# Altium schematic sheet ART-Pi_LCD&Camera.SchDoc: LCD_Connector
size A3; DocumentNumber: 9; Revision: V1.5; SheetNumber: 9; SheetTotal: 11; PageSetup: Record=PageOptions|CenterHorizontal=True|CenterVertical=True|PrintScale=1.01|XCorrection=1.00|YCorrection=1.00|PrintKind=0|BorderSize=5000000|LeftOffset=0|BottomOffset=0|Orientation=2|PaperLength=1000|PaperWidth=1000|Scale=100|PaperSource=7|PrintQuality=600|MediaType=1|DitherType=10|PrintScaleMode=1|PaperKind=A3(297x420mm)|PaperIndex=8
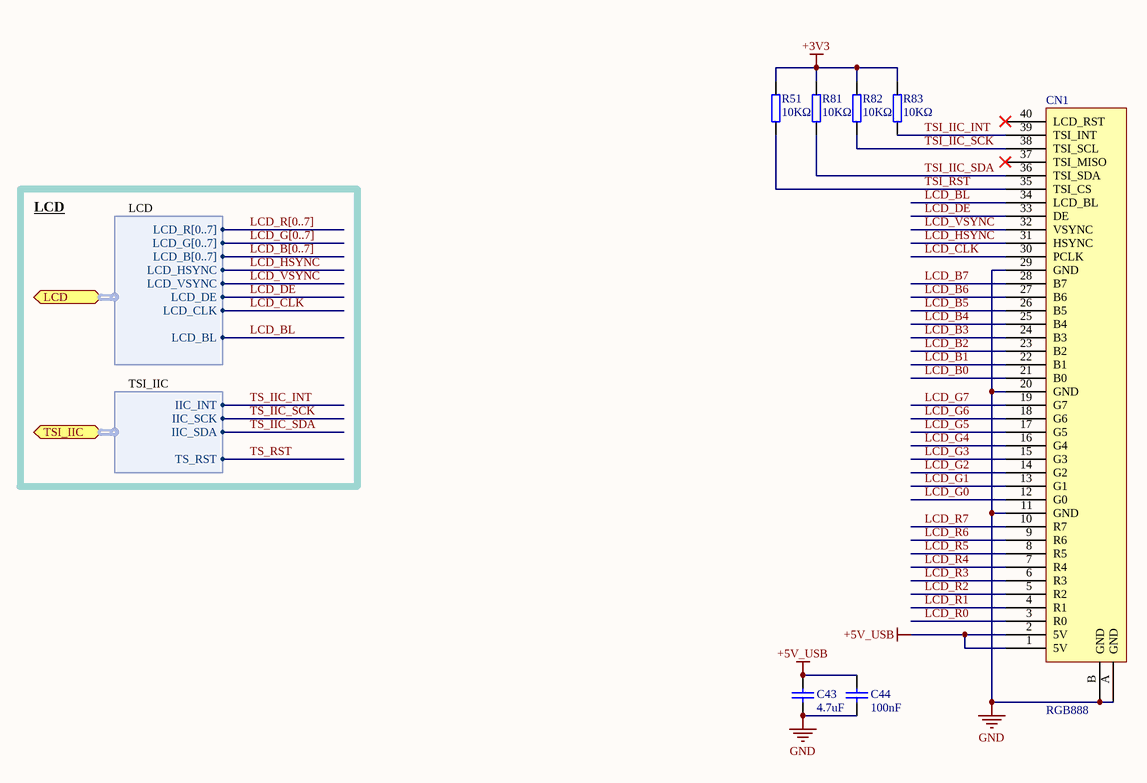
[diagram p0: ART-Pi_LCD&Camera.SchDoc]

## Parts
C43  4.7uF  [0402_C]
C44  100nF  [0402_C]
CN1  RGB888  [FPC-TOP40]
R51  10KΩ  [0402_R]
R81  10KΩ  [0402_R]
R82  10KΩ  [0402_R]
R83  10KΩ  [0402_R]

## Ports
LCD (harness Harness), TSI_IIC (harness Harness)

## Harnesses
Harness: IIC_INT, IIC_SCK, IIC_SDA, TS_RST
Harness: LCD_G[0..7], LCD_B[0..7], LCD_HSYNC, LCD_VSYNC, LCD_DE, LCD_CLK, LCD_BL, LCD_R[0..7]

## Nets
+3V3: R51.1 R81.1 R82.1 R83.1
+5V_USB: C43.2 C44.2 CN1.1(5V) CN1.2(5V)
GND: C43.1 C44.1 CN1.11(GND) CN1.20(GND) CN1.29(GND) CN1.A(GND) CN1.B(GND)
LCD_B0: CN1.21(B0)
LCD_B1: CN1.22(B1)
LCD_B2: CN1.23(B2)
LCD_B3: CN1.24(B3)
LCD_B4: CN1.25(B4)
LCD_B5: CN1.26(B5)
LCD_B6: CN1.27(B6)
LCD_B7: CN1.28(B7)
LCD_BL: CN1.34(LCD_BL) ; port LCD.LCD_BL
LCD_CLK: CN1.30(PCLK) ; port LCD.LCD_CLK
LCD_DE: CN1.33(DE) ; port LCD.LCD_DE
LCD_G0: CN1.12(G0)
LCD_G1: CN1.13(G1)
LCD_G2: CN1.14(G2)
LCD_G3: CN1.15(G3)
LCD_G4: CN1.16(G4)
LCD_G5: CN1.17(G5)
LCD_G6: CN1.18(G6)
LCD_G7: CN1.19(G7)
LCD_HSYNC: CN1.31(HSYNC) ; port LCD.LCD_HSYNC
LCD_R0: CN1.3(R0)
LCD_R1: CN1.4(R1)
LCD_R2: CN1.5(R2)
LCD_R3: CN1.6(R3)
LCD_R4: CN1.7(R4)
LCD_R5: CN1.8(R5)
LCD_R6: CN1.9(R6)
LCD_R7: CN1.10(R7)
LCD_VSYNC: CN1.32(VSYNC) ; port LCD.LCD_VSYNC
TS_IIC_INT: port TSI_IIC.IIC_INT
TS_IIC_SCK: port TSI_IIC.IIC_SCK
TS_IIC_SDA: port TSI_IIC.IIC_SDA
TS_RST: port TSI_IIC.TS_RST
TSI_IIC_INT: CN1.39(TSI_INT) R83.2
TSI_IIC_SCK: CN1.38(TSI_SCL) R82.2
TSI_IIC_SDA: CN1.36(TSI_SDA) R81.2
TSI_RST: CN1.35(TSI_CS) R51.2

Not connected (* = marked no-connect by the designer): CN1 37(TSI_MISO)* 40(LCD_RST)*

## Buses and harness runs
bus LCD_B[0..7]
bus LCD_G[0..7]
bus LCD_R[0..7]

## Notes on the sheet
- LCD
- TSI_IIC
- Title
- Size:
- Date:
- A3
- Number:
- Time:
- Revision:
- Sheet
- of
- File:

## Library data of the parts
C43 C44 = Cap: Capacitor; Published: 8-Jun-2000; LatestRevisionDate: 17-Jul-2002; LatestRevisionNote: Re-released for DXP Platform.; PackageReference: RAD-0.3; Publisher: Altium Limited; PackageDescription: Radial Cap, Thru-Hole; 2 Leads; 0.3 in Pin Spacing
CN1 = FPC-40: FPC-40P-0.5mm
R51 R81-R83 = Res: Resister